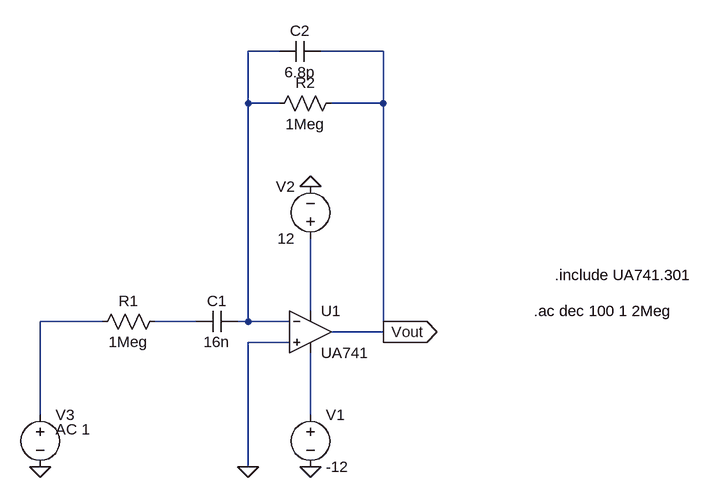
[diagram p0: schematic Draft1.asc]
Draft1.asc, the LTspice schematic file:
Version 4
SHEET 1 1056 680
WIRE 416 -112 368 -112
WIRE 576 -112 480 -112
WIRE 368 -32 368 -112
WIRE 416 -32 368 -32
WIRE 576 -32 576 -112
WIRE 576 -32 496 -32
WIRE 464 288 464 176
WIRE 144 304 48 304
WIRE 288 304 224 304
WIRE 368 304 368 -32
WIRE 368 304 352 304
WIRE 432 304 368 304
WIRE 576 320 576 -32
WIRE 576 320 496 320
WIRE 432 336 368 336
WIRE 48 448 48 304
WIRE 464 448 464 352
WIRE 368 528 368 336
FLAG 464 96 0
FLAG 464 528 0
FLAG 368 528 0
FLAG 48 528 0
FLAG 576 320 Vout
IOPIN 576 320 Out
SYMBOL OpAmps/opamp2 464 256 R0
SYMATTR InstName U1
SYMATTR Value UA741
SYMBOL Voltage 464 432 R0
SYMATTR InstName V1
SYMATTR Value -12
SYMBOL Voltage 464 192 R180
WINDOW 0 24 96 Left 2
WINDOW 3 24 16 Left 2
SYMATTR InstName V2
SYMATTR Value 12
SYMBOL Res 240 288 R90
WINDOW 0 0 56 VBottom 2
WINDOW 3 32 56 VTop 2
SYMATTR InstName R1
SYMATTR Value 1Meg
SYMBOL Cap 352 288 R90
WINDOW 0 0 32 VBottom 2
WINDOW 3 32 32 VTop 2
SYMATTR InstName C1
SYMATTR Value 16n
SYMBOL Voltage 48 432 R0
WINDOW 123 24 38 Left 2
SYMATTR InstName V3
SYMATTR Value ""
SYMATTR Value2 AC 1
SYMBOL Res 512 -48 R90
WINDOW 0 0 56 VBottom 2
WINDOW 3 32 56 VTop 2
SYMATTR InstName R2
SYMATTR Value 1Meg
SYMBOL Cap 480 -128 R90
WINDOW 0 0 32 VBottom 2
WINDOW 3 32 32 VTop 2
SYMATTR InstName C2
SYMATTR Value 6.8p
TEXT 840 232 Left 2 !.include UA741.301
TEXT 808 288 Left 2 !.ac dec 100 1 2Meg

The netlist it stands for:
* Draft1.asc
XU1 0 N001 N002 N005 Vout UA741  ; pins In+ In- V+ V- OUT
V1 N005 0 -12
V2 N002 0 12
R1 N004 N003 1Meg
C1 N001 N004 16n
V3 N003 0 AC 1
R2 Vout N001 1Meg
C2 Vout N001 6.8p
.include UA741.301
.ac dec 100 1 2Meg
.backanno
.end